# EAGLE schematic breakout-soic8 (EAGLE 6.5.0)
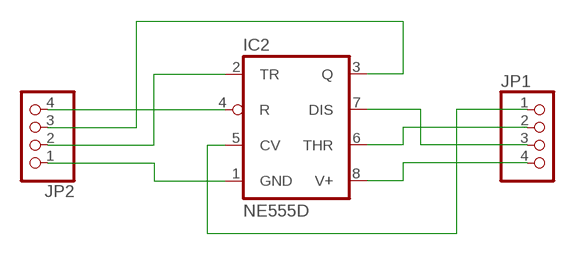
[diagram p0: schematic, sheet 1]

## Parts
IC2  NE555D  [SO08]
JP1  PINHD-1X4  [1X04]
JP2  PINHD-1X4  [1X04]

## Nets
N$1: IC2.1(GND) JP2.1
N$2: IC2.2(TR) JP2.2
N$3: IC2.3(Q) JP2.3
N$4: IC2.4(R) JP2.4
N$5: IC2.5(CV) JP1.1
N$6: IC2.6(THR) JP1.2
N$7: IC2.7(DIS) JP1.3
N$8: IC2.8(V+) JP1.4

## Library data of the parts
IC2 = linear:*555: TIMER
JP1 JP2 = pinhead:PINHD-1X4: PIN HEADER